# Altium schematic sheet 07_AUDIO.SchDoc
size A4
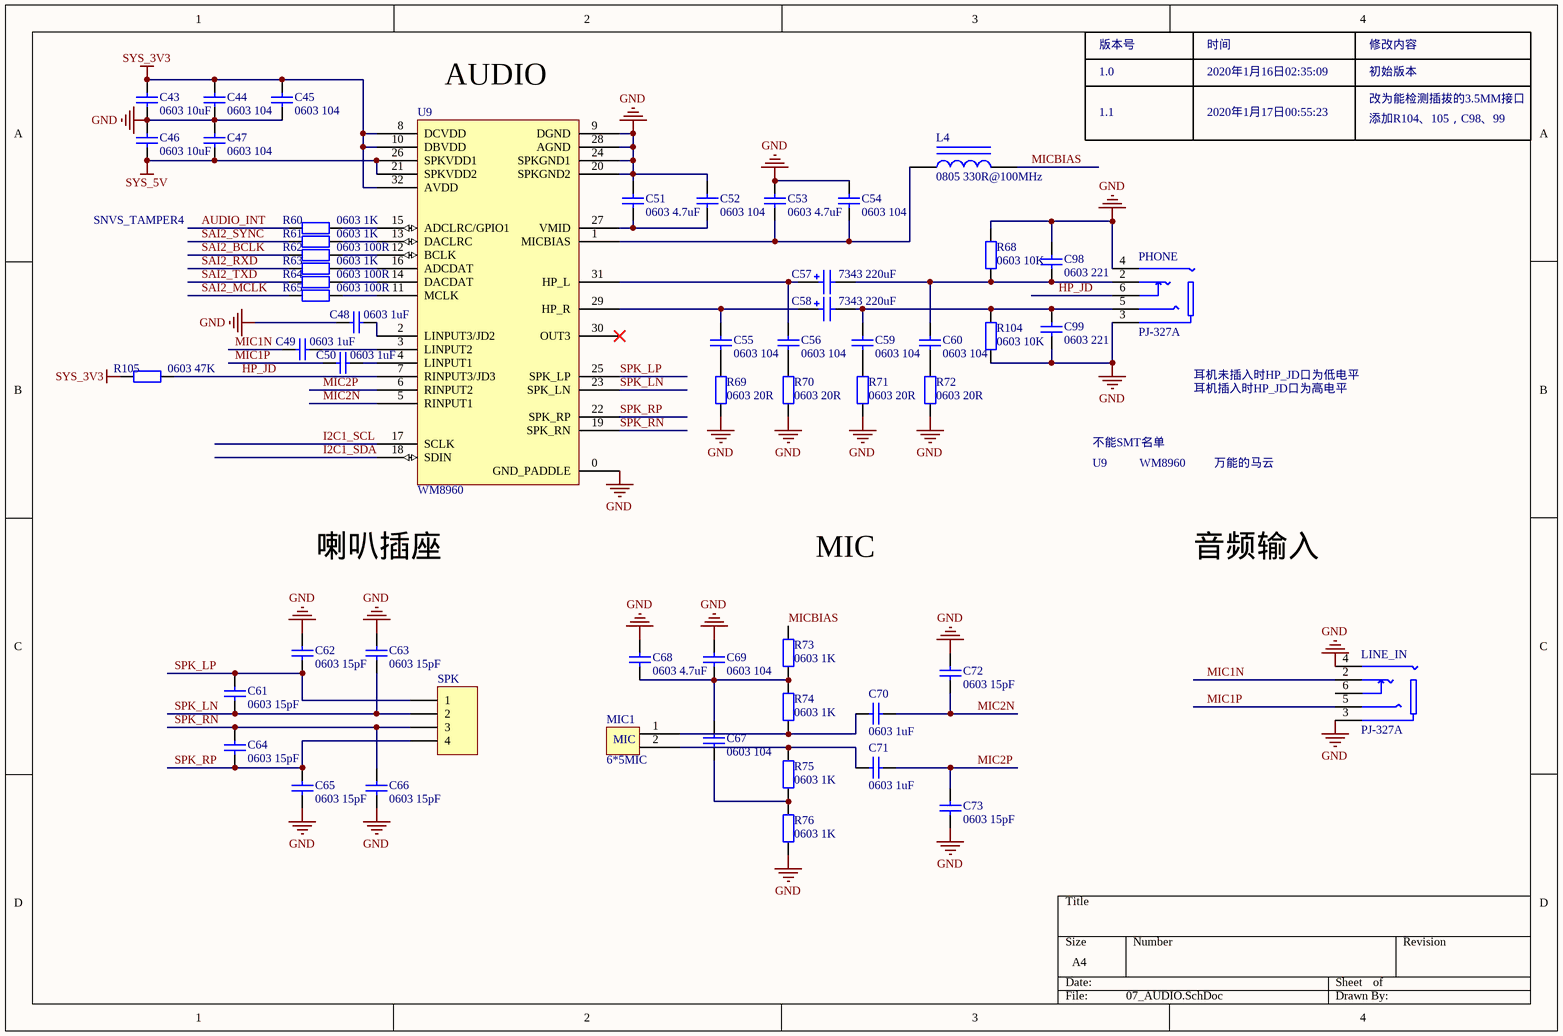
[diagram p0: 07_AUDIO.SchDoc]

## Parts
C43  0603 10uF  [LC-0603_C]
C44  0603 104  [LC-0603_C]
C45  0603 104  [LC-0603_C]
C46  0603 10uF  [LC-0603_C]
C47  0603 104  [LC-0603_C]
C48  0603 1uF  [LC-0603_C]
C49  0603 1uF  [LC-0603_C]
C50  0603 1uF  [LC-0603_C]
C51  0603 4.7uF  [LC-0603_C]
C52  0603 104  [LC-0603_C]
C53  0603 4.7uF  [LC-0603_C]
C54  0603 104  [LC-0603_C]
C55  0603 104  [LC-0603_C]
C56  0603 104  [LC-0603_C]
C57  7343 220uF  [Ta7343]
C58  7343 220uF  [Ta7343]
C59  0603 104  [LC-0603_C]
C60  0603 104  [LC-0603_C]
C61  0603 15pF  [LC-0603_C]
C62  0603 15pF  [LC-0603_C]
C63  0603 15pF  [LC-0603_C]
C64  0603 15pF  [LC-0603_C]
C65  0603 15pF  [LC-0603_C]
C66  0603 15pF  [LC-0603_C]
C67  0603 104  [LC-0603_C]
C68  0603 4.7uF  [LC-0603_C]
C69  0603 104  [LC-0603_C]
C70  0603 1uF  [LC-0603_C]
C71  0603 1uF  [LC-0603_C]
C72  0603 15pF  [LC-0603_C]
C73  0603 15pF  [LC-0603_C]
C98  0603 221  [LC-0603_C]
C99  0603 221  [LC-0603_C]
L4  0805 330R@100MHz  [LC-0805_L]
LINE_IN  PJ-327A  [PJ-327A]
MIC1  6*5MIC  [6*5MIC]
PHONE  PJ-327A  [PJ-327A]
R60  0603 1K  [LC-0603_R]
R61  0603 1K  [LC-0603_R]
R62  0603 100R  [LC-0603_R]
R63  0603 1K  [LC-0603_R]
R64  0603 100R  [LC-0603_R]
R65  0603 100R  [LC-0603_R]
R68  0603 10K  [LC-0603_R]
R69  0603 20R  [LC-0603_R]
R70  0603 20R  [LC-0603_R]
R71  0603 20R  [LC-0603_R]
R72  0603 20R  [LC-0603_R]
R73  0603 1K  [LC-0603_R]
R74  0603 1K  [LC-0603_R]
R75  0603 1K  [LC-0603_R]
R76  0603 1K  [LC-0603_R]
R104  0603 10K  [LC-0603_R]
R105  0603 47K  [LC-0603_R]
SPK  (no value)  [HDR1X4]
U9  WM8960  [LC-QFN-32_5x5x05P]

## Nets
GND: C43.1 C44.1 C45.1 C46.2 C47.2 C48.2 C51.1 C52.1 C53.1 C54.1 C62.1 C63.1 C65.1 C66.1 C68.1 C69.1 C72.2 C73.1 C98.1 C99.2 LINE_IN.3 LINE_IN.4 PHONE.3 PHONE.4 R68.1 R69.2 R70.2 R71.2 R72.2 R76.2 R104.1 U9.0(GND_PADDLE) U9.9(DGND) U9.20(SPKGND2) U9.24(SPKGND1) U9.28(AGND)
SYS_3V3: C43.2 C44.2 C45.2 R105.1 U9.8(DCVDD) U9.10(DBVDD) U9.32(AVDD)
SYS_5V: C46.1 C47.1 U9.21(SPKVDD2) U9.26(SPKVDD1)
AUDIO_INT: R60.1
HP_JD: PHONE.6 R105.2 U9.7(RINPUT3/JD3)
I2C1_SCL: U9.17(SCLK)
I2C1_SDA: U9.18(SDIN)
MIC1N: C49.2 LINE_IN.2
MIC1P: C50.2 LINE_IN.5
MIC2N: C70.2 C72.1 U9.5(RINPUT1)
MIC2P: C71.2 C73.2 U9.6(RINPUT2)
MICBIAS: L4.2 R73.1
SAI2_BCLK: R62.1
SAI2_MCLK: R65.1
SAI2_RXD: R63.1
SAI2_SYNC: R61.1
SAI2_TXD: R64.1
SPK_LN: C61.2 C63.2 SPK.2 U9.23(SPK_LN)
SPK_LP: C61.1 C62.2 SPK.1 U9.25(SPK_LP)
SPK_RN: C64.2 C66.2 SPK.3 U9.19(SPK_RN)
SPK_RP: C64.1 C65.2 SPK.4 U9.22(SPK_RP)
NetC48_1: C48.1 U9.2(LINPUT3/JD2)
NetC49_1: C49.1 U9.3(LINPUT2)
NetC50_1: C50.1 U9.4(LINPUT1)
NetC51_2: C51.2 C52.2 U9.27(VMID)
NetC53_2: C53.2 C54.2 L4.1 U9.1(MICBIAS)
NetC55_1: C55.1 C58.1 U9.29(HP_R)
NetC55_2: C55.2 R69.1
NetC56_1: C56.1 C57.1 U9.31(HP_L)
NetC56_2: C56.2 R70.1
NetC57_2: C57.2 C60.1 C98.2 PHONE.2 R68.2
NetC58_2: C58.2 C59.1 C99.1 PHONE.5 R104.2
NetC59_2: C59.2 R71.1
NetC60_2: C60.2 R72.1
NetC67_1: C67.1 R75.2 R76.1
NetC67_2: C67.2 C68.2 C69.2 R73.2 R74.1
NetC70_1: C70.1 MIC1.1 R74.2
NetC71_1: C71.1 MIC1.2 R75.1
NetR60_2: R60.2 U9.15(ADCLRC/GPIO1)
NetR61_2: R61.2 U9.13(DACLRC)
NetR62_2: R62.2 U9.12(BCLK)
NetR63_2: R63.2 U9.16(ADCDAT)
NetR64_2: R64.2 U9.14(DACDAT)
NetR65_2: R65.2 U9.11(MCLK)

Not connected (* = marked no-connect by the designer): LINE_IN 6; U9 30(OUT3)*

## Notes on the sheet
- (near U9) AUDIO
- 版本号
- 1.0
- 1.1
- 2020年1月16日02:35:09
- 时间
- 2020年1月17日00:55:23
- 修改内容
- 初始版本
- 改为能检测插拔的3.5MM接口
- 添加R104、105，C98、99
- SNVS_TAMPER4
- 耳机未插入时HP_JD口为低电平
- 不能SMT名单
- 耳机插入时HP_JD口为高电平
- U9
- WM8960
- 万能的马云
- 喇叭插座
- MIC
- 音频输入
- (in symbol 6*5MIC) MIC

## Library data of the parts
C43-C56 C59-C73 C98 C99 = 0603 1.5nF (152) 10% 50V: 贴片电容; ComponentLink1Description: 供应商链接; ComponentLink1URL: http://www.szlcsc.com/product/details_1947.html; Package: 0603; Supplier: LC; SuppliersPartNumber: C1595
C57 C58 = CAP1
L4 = 0805 1uH 10%: 贴片电感; ComponentLink1URL: http://www.szlcsc.com/product/details_1394.html; Package: 0805; Supplier: LC; SuppliersPartNumber: C1042
R60-R65 R68-R76 R104 R105 = 0603 1.1KΩ (1101) 1%: 贴片电阻; ComponentLink1Description: 供应商链接; ComponentLink1URL: http://www.szlcsc.com/product/details_23491.html; Package: 0603; Supplier: LC; SuppliersPartNumber: C22764
SPK = Header 4: Header, 4-Pin; LatestRevisionDate: 17-Jul-2002; LatestRevisionNote: Re-released for DXP Platform.; Publisher: Altium Limited